# Altium project bailey.PrjPcb (part 4 of 11)
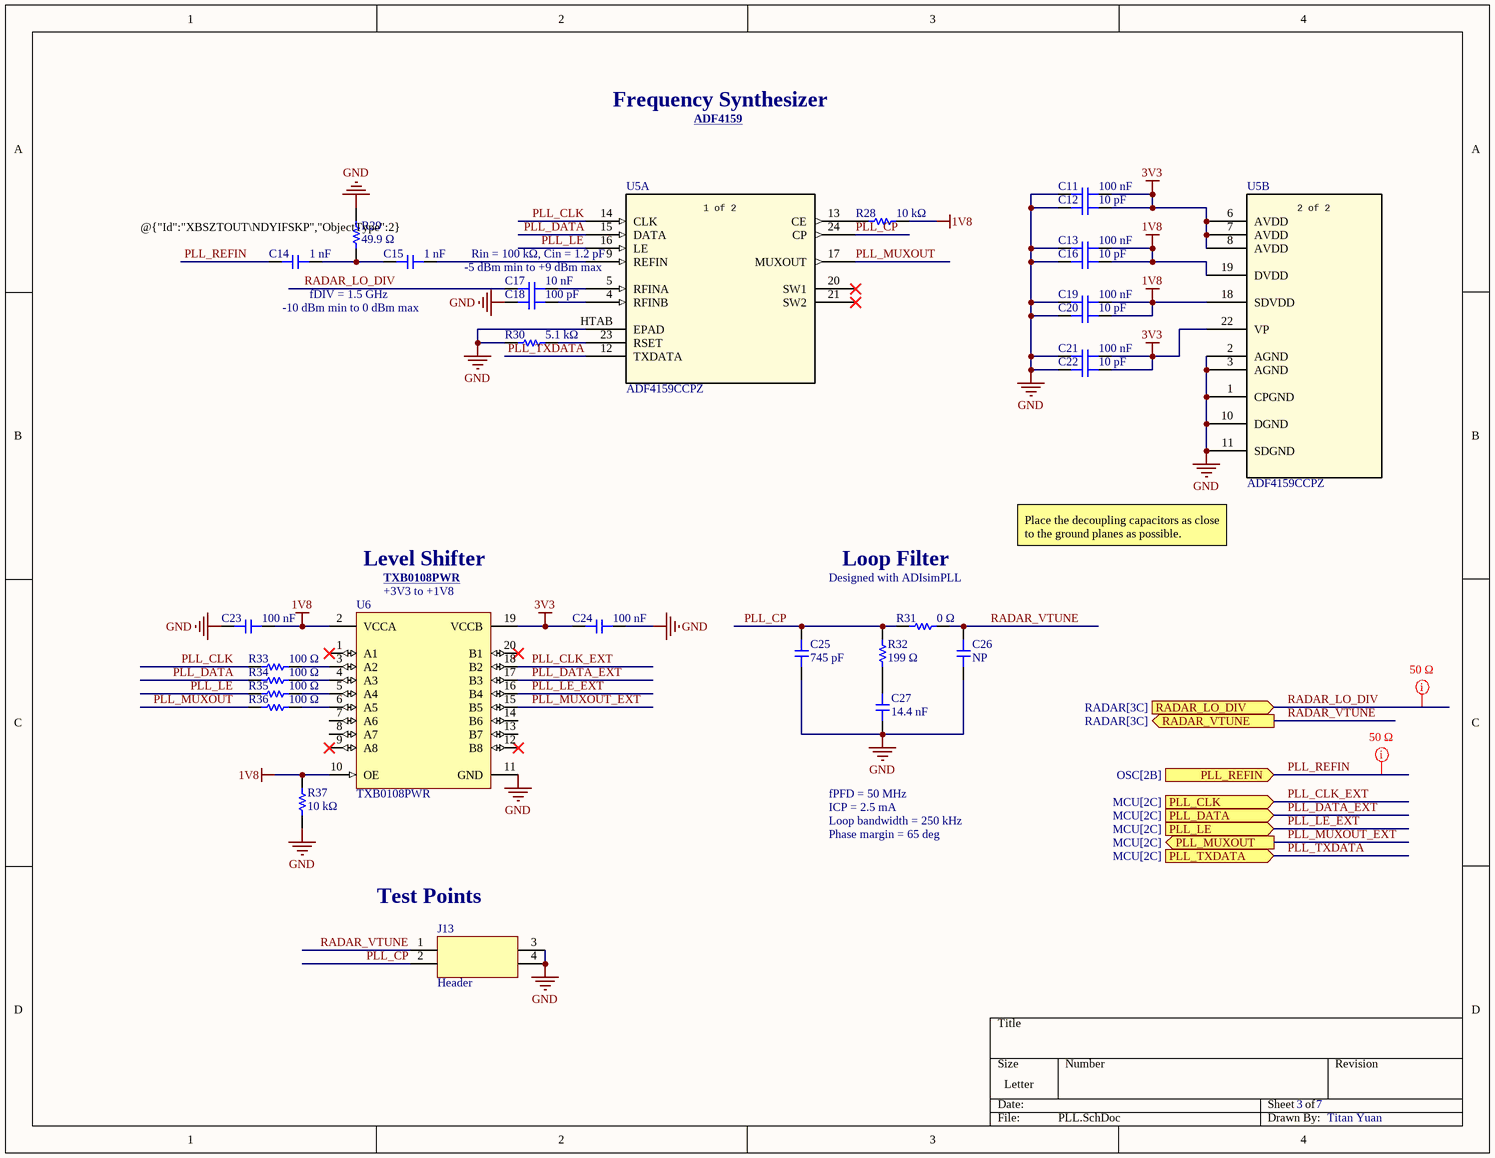
[diagram p9: PLL.SchDoc]

## Sheet PLL.SchDoc (continued)
### Library data of the parts
C11 C13 C19 C21 C23 C24 = CAP: 25V 100nF X7R ±10% 0402 Multilayer Ceramic Capacitors MLCC - SMD/SMT ROHS; Manufacturer: Samsung Electro-Mechanics; Manufacturer Part Number: CL05B104KA5NNNC; Tolerance: 10%; Voltage Rating: 25 V; Dielectric: Ceramic; Package Size: 0402; Supplier: DigiKey; Supplier Part Number: 1276-6720-1-ND; RoHS: Compliant; Category: Ceramic Capacitors; Stock: 5149468; Pricing: 1=0.08, 10=0.002 (USD); Value: 100nF; Case/Package: 0402; Case Code (Imperial): 0402; Case Code (Metric): 1005; China RoHS: Compliant; Country of Origin: Mainland China, Philippines, South Korea; Dielectric Material: Ceramic; Export Control Classification Number (ECCN) Code: EAR99; Height: 500µm; Harmonized Tariff Schedule (HTS) Code: 8532.24.00.20; Introduction Date: 2009-10-27; Length: 1mm; Lifecycle Status: Production; Material: Ceramic; Max Operating Temperature: 125°C; Min Operating Temperature: -55°C; Mounting Technology: Surface Mount; Number of Terminals: 2; REACH SVHC: Yes; Schedule B: 8532240020, 8532240020|8532240020|8532240020|8532240020|8532240020|8532240020|8532240020|8532240020|8532240020|8532240020|8532240020|8532240020|8532240020|8532240020|8532240020|8532240020|8532240020|8532240020|8532240020|8532240020|8532240020|8532240020|8532240020|85; Thickness: 558.8µm; Voltage Rating (DC): 25V; Width: 500µm; ComponentLink1URL: https://datasheet.octopart.com:443/CL05B104KA5NNNC-Samsung-Electro-Mechanics-datasheet-136876160.pdf?src-supplier=Samsung+SCT; ComponentLink1Description: https://datasheet.octopart.com:443/CL05B104KA5NNNC-Samsung-Electro-Mechanics-datasheet-136876160.pdf?src-supplier=Samsung+SCT; ComponentLink2URL: https://datasheet.octopart.com:443/CL05B104KA5NNNC-Samsung-Electro-Mechanics-datasheet-116890910.pdf?src-supplier=Future+Electronics; ComponentLink2Description: https://datasheet.octopart.com:443/CL05B104KA5NNNC-Samsung-Electro-Mechanics-datasheet-116890910.pdf?src-supplier=Future+Electronics; ComponentLink3URL: https://datasheet.octopart.com:443/CL05B104KA5NNNC-Samsung-Electro-Mechanics-datasheet-104201047.pdf?src-supplier=Future+Electronics; ComponentLink3Description: https://datasheet.octopart.com:443/CL05B104KA5NNNC-Samsung-Electro-Mechanics-datasheet-104201047.pdf?src-supplier=Future+Electronics; ComponentLink4URL: https://datasheet.octopart.com:443/CL05B104KA5NNNC-Samsung-Electro-Mechanics-datasheet-148801811.pdf?src-supplier=Future+Electronics; ComponentLink4Description: https://datasheet.octopart.com:443/CL05B104KA5NNNC-Samsung-Electro-Mechanics-datasheet-148801811.pdf?src-supplier=Future+Electronics; ComponentLink5URL: https://datasheet.octopart.com/CL05B104KA5NNNC-Samsung-Electro-Mechanics-datasheet-97040617.pdf; ComponentLink5Description: https://datasheet.octopart.com/CL05B104KA5NNNC-Samsung-Electro-Mechanics-datasheet-97040617.pdf; ComponentLink6URL: https://datasheet.octopart.com/CL05B104KA5NNNC-Samsung-Electro-Mechanics-datasheet-8324245.pdf; ComponentLink6Description: https://datasheet.octopart.com/CL05B104KA5NNNC-Samsung-Electro-Mechanics-datasheet-8324245.pdf; ComponentLink7URL: https://datasheet.octopart.com/General-Multilayer-Ceramic-Capacitors-Samsung-datasheet-family-111.pdf; ComponentLink7Description: https://datasheet.octopart.com/General-Multilayer-Ceramic-Capacitors-Samsung-datasheet-family-111.pdf; ComponentLink8URL: https://datasheet.octopart.com:443/CL05B104KA5NNNC-Samsung-datasheet-8326407.pdf?src-supplier=TME; ComponentLink8Description: https://datasheet.octopart.com:443/CL05B104KA5NNNC-Samsung-datasheet-8326407.pdf?src-supplier=TME; ComponentLink9URL: http://sigma.octopart.com:80/rohs_certificate/General-Multilayer-Ceramic-Capacitors-Samsung-family-110.pdf?src-supplier=Compliance+Statements; ComponentLink9Description: http://sigma.octopart.com:80/rohs_certificate/General-Multilayer-Ceramic-Capacitors-Samsung-family-110.pdf?src-supplier=Compliance+Statements; ComponentLink10URL: http://sigma.octopart.com:80/rohs_statement/General-Multilayer-Ceramic-Capacitors-Samsung-family-132.pdf?src-supplier=Compliance+Statements; ComponentLink10Description: http://sigma.octopart.com:80/rohs_statement/General-Multilayer-Ceramic-Capacitors-Samsung-family-132.pdf?src-supplier=Compliance+Statements; ComponentLink11URL: http://sigma.octopart.com:80/reach_statement/General-Multilayer-Ceramic-Capacitors-Samsung-family-133.pdf?src-supplier=Compliance+Statements; ComponentLink11Description: http://sigma.octopart.com:80/reach_statement/General-Multilayer-Ceramic-Capacitors-Samsung-family-133.pdf?src-supplier=Compliance+Statements
C12 C16 C20 C22 = CAP: 50V 10pF C0G ±5% 0402 Multilayer Ceramic Capacitors MLCC - SMD/SMT ROHS; Manufacturer: Murata Electronics; Manufacturer Part Number: GRM1555C1H100JA01D; Manufacturer Lifecycle Status: NRND; Temperature Coefficient: 30ppm/°C; Tolerance: 5%; Voltage Rating: 50 V; Dielectric: Ceramic; Package Size: 0402; Supplier: DigiKey; Supplier Part Number: 490-5921-1-ND; RoHS: Compliant; Category: Ceramic Capacitors; Stock: 712856; Pricing: 1=0.1, 10=0.022, 50=0.0144, 100=0.0122, 500=0.0085, 1000=0.00738, 2500=0.0062, 5000=0.0055, 10000=0.00503, 20000=0.00454, 30000=0.0043, 50000=0.00404, 70000=0.00388, 100000=0.00373, 120000=0.00366, 240000=0.00342, 250000=0.00341 (USD); Value: 10pF; Case/Package: 0402; Case Code (Imperial): 0402; Case Code (Metric): 1005; Country of Origin: Singapore; Depth: 500µm; Dielectric Material: Ceramic; Export Control Classification Number (ECCN) Code: EAR99; Height: 500µm; Harmonized Tariff Schedule (HTS) Code: 8532.24.00.20; Introduction Date: 2003-10-14; Lead Free: Lead Free; Length: 1mm; Lifecycle Status: NRND; Material: Ceramic; Max Operating Temperature: 125°C; Min Operating Temperature: -55°C; Mounting Technology: Surface Mount; Pins: 2; Number of Terminals: 2; Packaging: Cut Tape; Radiation Hardening: No; REACH SVHC: Yes; Schedule B: 8532240020, 8532240020|8532240020, 8532240020|8532240020|8532240020, 8532240020|8532240020|8532240020|8532240020; Termination: SMD/SMT; Thickness: 500µm; Voltage: 50V; Voltage Rating (DC): 50V; Width: 500µm; ComponentLink1URL: https://datasheet.octopart.com:443/GRM1555C1H100JA01D-Murata-datasheet-12559435.pdf?src-supplier=element14+APAC; ComponentLink1Description: https://datasheet.octopart.com:443/GRM1555C1H100JA01D-Murata-datasheet-12559435.pdf?src-supplier=element14+APAC; ComponentLink2URL: https://datasheet.octopart.com:443/GRM1555C1H100JA01D-Murata-datasheet-62317042.pdf?src-supplier=element14+APAC; ComponentLink2Description: https://datasheet.octopart.com:443/GRM1555C1H100JA01D-Murata-datasheet-62317042.pdf?src-supplier=element14+APAC; ComponentLink3URL: https://datasheet.octopart.com:443/GRM1555C1H100JA01D-Murata-datasheet-501912.pdf?src-supplier=element14+APAC; ComponentLink3Description: https://datasheet.octopart.com:443/GRM1555C1H100JA01D-Murata-datasheet-501912.pdf?src-supplier=element14+APAC; ComponentLink4URL: https://datasheet.octopart.com:443/GRM1555C1H100JA01D-Murata-datasheet-11857477.pdf?src-supplier=_legacy+Avnet; ComponentLink4Description: https://datasheet.octopart.com:443/GRM1555C1H100JA01D-Murata-datasheet-11857477.pdf?src-supplier=_legacy+Avnet; ComponentLink5URL: https://datasheet.octopart.com:443/GRM1555C1H100JA01D-Murata-datasheet-14396362.pdf?src-supplier=Future+Electronics; ComponentLink5Description: https://datasheet.octopart.com:443/GRM1555C1H100JA01D-Murata-datasheet-14396362.pdf?src-supplier=Future+Electronics; ComponentLink6URL: https://datasheet.octopart.com:443/GRM1555C1H100JA01D-Murata-datasheet-22122223.pdf?src-supplier=Future+Electronics; ComponentLink6Description: https://datasheet.octopart.com:443/GRM1555C1H100JA01D-Murata-datasheet-22122223.pdf?src-supplier=Future+Electronics; ComponentLink7URL: https://datasheet.octopart.com:443/GRM1555C1H100JA01D-Murata-datasheet-44105796.pdf?src-supplier=Future+Electronics; ComponentLink7Description: https://datasheet.octopart.com:443/GRM1555C1H100JA01D-Murata-datasheet-44105796.pdf?src-supplier=Future+Electronics; ComponentLink8URL: https://datasheet.octopart.com:443/GRM1555C1H100JA01D-Murata-datasheet-165579666.pdf?src-supplier=TME; ComponentLink8Description: https://datasheet.octopart.com:443/GRM1555C1H100JA01D-Murata-datasheet-165579666.pdf?src-supplier=TME; ComponentLink9URL: https://datasheet.octopart.com:443/GRM1555C1H100JA01D-Murata-datasheet-59876780.pdf?src-supplier=TME; ComponentLink9Description: https://datasheet.octopart.com:443/GRM1555C1H100JA01D-Murata-datasheet-59876780.pdf?src-supplier=TME; ComponentLink10URL: https://datasheet.octopart.com:443/GRM1555C1H100JA01D-Murata-datasheet-141266224.pdf?src-supplier=Ciiva; ComponentLink10Description: https://datasheet.octopart.com:443/GRM1555C1H100JA01D-Murata-datasheet-141266224.pdf?src-supplier=Ciiva; ComponentLink11URL: https://datasheet.octopart.com:443/GRM1555C1H100JA01D-Murata-datasheet-140680755.pdf?src-supplier=Ciiva; ComponentLink11Description: https://datasheet.octopart.com:443/GRM1555C1H100JA01D-Murata-datasheet-140680755.pdf?src-supplier=Ciiva; ComponentLink12URL: https://datasheet.octopart.com:443/GRM1555C1H100JA01D-Murata-datasheet-138739439.pdf?src-supplier=Ciiva; ComponentLink12Description: https://datasheet.octopart.com:443/GRM1555C1H100JA01D-Murata-datasheet-138739439.pdf?src-supplier=Ciiva; ComponentLink13URL: https://datasheet.octopart.com/GRM1555C1H100JA01D-Murata-datasheet-12515295.pdf; ComponentLink13Description: https://datasheet.octopart.com/GRM1555C1H100JA01D-Murata-datasheet-12515295.pdf; ComponentLink14URL: https://datasheet.octopart.com/GRM1555C1H100JA01D-Murata-datasheet-12510076.pdf; ComponentLink14Description: https://datasheet.octopart.com/GRM1555C1H100JA01D-Murata-datasheet-12510076.pdf; ComponentLink15URL: https://datasheet.octopart.com/GRM1555C1H100JA01D-Murata-datasheet-11978611.pdf; ComponentLink15Description: https://datasheet.octopart.com/GRM1555C1H100JA01D-Murata-datasheet-11978611.pdf; ComponentLink16URL: https://datasheet.octopart.com/GRM1555C1H100JA01D-Murata-datasheet-10025737.pdf; ComponentLink16Description: https://datasheet.octopart.com/GRM1555C1H100JA01D-Murata-datasheet-10025737.pdf; ComponentLink17URL: https://datasheet.octopart.com/GRM1555C1H100JA01D-Murata-datasheet-8819587.pdf; ComponentLink17Description: https://datasheet.octopart.com/GRM1555C1H100JA01D-Murata-datasheet-8819587.pdf; ComponentLink18URL: http://sigma.octopart.com:80/reach_statement/Murata-company-16.pdf?src-supplier=Compliance+Statements; ComponentLink18Description: http://sigma.octopart.com:80/reach_statement/Murata-company-16.pdf?src-supplier=Compliance+Statements
C14 C15 = CAP: 50V 1nF X7R ±10% 0402 Multilayer Ceramic Capacitors MLCC - SMD/SMT ROHS; Manufacturer: Yageo; Manufacturer Part Number: CC0402KRX7R9BB102; Insulation Resistance: 100GΩ; Temperature Coefficient: 30ppm/°C; Tolerance: 10%; Voltage Rating: 50 V; Dielectric: Ceramic; Package Size: 0402; Supplier: DigiKey; Supplier Part Number: 311-1036-1-ND; RoHS: Compliant; Category: Ceramic Capacitors; Stock: 1584347; Pricing: 1=0.08, 10=0.003, 10000=0.0024 (USD); Value: 1nF; Case/Package: 0402; Case Code (Imperial): 0402; Case Code (Metric): 1005; China RoHS: Compliant; Composition: Ceramic; Country of Origin: Mainland China, Taiwan; Depth: 500µm; Dielectric Material: Ceramic; Export Control Classification Number (ECCN) Code: EAR99; Halogen Free: Halogen Free; Height: 500µm; Harmonized Tariff Schedule (HTS) Code: 8532.24.00.20; Introduction Date: 2003-01-27; Lead Free: Lead Free; Length: 1mm; Lifecycle Status: Production; Material: Ceramic; Max Operating Temperature: 125°C; Min Operating Temperature: -55°C; Mounting Technology: Surface Mount; Pins: 2; Number of Terminals: 2; Radiation Hardening: No; REACH SVHC: Yes; Schedule B: 8532240020, 8532240020|8532240020|8532240020|8532240020|8532240020|8532240020|8532240020|8532240020|8532240020|8532240020|8532240020|8532240020|8532240020|8532240020|8532240020|8532240020|8532240020|8532240020|8532240020|8532240020|8532240020|8532240020|8532240020|85; Termination: SMD/SMT; Thickness: 558.8µm; Voltage: 50V; Voltage Rating (AC): 50V; Voltage Rating (DC): 50V; Width: 500µm; ComponentLink1URL: https://datasheet.octopart.com:443/CC0402KRX7R9BB102-Yageo-datasheet-177165144.pdf?src-supplier=IHS; ComponentLink1Description: https://datasheet.octopart.com:443/CC0402KRX7R9BB102-Yageo-datasheet-177165144.pdf?src-supplier=IHS; ComponentLink2URL: https://datasheet.octopart.com:443/CC0402KRX7R9BB102-Yageo-datasheet-82288757.pdf?src-supplier=Upverter; ComponentLink2Description: https://datasheet.octopart.com:443/CC0402KRX7R9BB102-Yageo-datasheet-82288757.pdf?src-supplier=Upverter; ComponentLink3URL: https://datasheet.octopart.com:443/CC0402KRX7R9BB102-Yageo-datasheet-78855684.pdf?src-supplier=Upverter; ComponentLink3Description: https://datasheet.octopart.com:443/CC0402KRX7R9BB102-Yageo-datasheet-78855684.pdf?src-supplier=Upverter; ComponentLink4URL: https://datasheet.octopart.com/CC0402KRX7R9BB102-Yageo-datasheet-10883670.pdf; ComponentLink4Description: https://datasheet.octopart.com/CC0402KRX7R9BB102-Yageo-datasheet-10883670.pdf; ComponentLink5URL: https://datasheet.octopart.com/CC0402KRX7R9BB102-Yageo-datasheet-12526321.pdf; ComponentLink5Description: https://datasheet.octopart.com/CC0402KRX7R9BB102-Yageo-datasheet-12526321.pdf; ComponentLink6URL: https://datasheet.octopart.com:443/CC0402KRX7R9BB102-Yageo-datasheet-147453679.pdf?src-supplier=Farnell; ComponentLink6Description: https://datasheet.octopart.com:443/CC0402KRX7R9BB102-Yageo-datasheet-147453679.pdf?src-supplier=Farnell; ComponentLink7URL: https://datasheet.octopart.com:443/CC0402KRX7R9BB102-Yageo-datasheet-151948686.pdf?src-supplier=Farnell; ComponentLink7Description: https://datasheet.octopart.com:443/CC0402KRX7R9BB102-Yageo-datasheet-151948686.pdf?src-supplier=Farnell; ComponentLink8URL: https://datasheet.octopart.com:443/CC0402KRX7R9BB102-Phycomp-datasheet-500777.pdf?src-supplier=Farnell; ComponentLink8Description: https://datasheet.octopart.com:443/CC0402KRX7R9BB102-Phycomp-datasheet-500777.pdf?src-supplier=Farnell; ComponentLink9URL: https://datasheet.octopart.com:443/CC0402KRX7R9BB102-Yageo-datasheet-5301394.pdf?src-supplier=Newark; ComponentLink9Description: https://datasheet.octopart.com:443/CC0402KRX7R9BB102-Yageo-datasheet-5301394.pdf?src-supplier=Newark; ComponentLink10URL: https://datasheet.octopart.com:443/CC0402KRX7R9BB102-Yageo-datasheet-62336348.pdf?src-supplier=Newark; ComponentLink10Description: https://datasheet.octopart.com:443/CC0402KRX7R9BB102-Yageo-datasheet-62336348.pdf?src-supplier=Newark; ComponentLink11URL: https://datasheet.octopart.com:443/CC0402KRX7R9BB102-Yageo-datasheet-182878162.pdf?src-supplier=Newark; ComponentLink11Description: https://datasheet.octopart.com:443/CC0402KRX7R9BB102-Yageo-datasheet-182878162.pdf?src-supplier=Newark; ComponentLink12URL: https://datasheet.octopart.com:443/CC0402KRX7R9BB102-Phycomp-datasheet-499490.pdf?src-supplier=element14; ComponentLink12Description: https://datasheet.octopart.com:443/CC0402KRX7R9BB102-Phycomp-datasheet-499490.pdf?src-supplier=element14; ComponentLink13URL: https://datasheet.octopart.com:443/CC0402KRX7R9BB102-Yageo-datasheet-8701427.pdf?src-supplier=element14; ComponentLink13Description: https://datasheet.octopart.com:443/CC0402KRX7R9BB102-Yageo-datasheet-8701427.pdf?src-supplier=element14; ComponentLink14URL: https://datasheet.octopart.com:443/CC0402KRX7R9BB102-Yageo-datasheet-166511530.pdf?src-supplier=Future+Electronics; ComponentLink14Description: https://datasheet.octopart.com:443/CC0402KRX7R9BB102-Yageo-datasheet-166511530.pdf?src-supplier=Future+Electronics; ComponentLink15URL: https://datasheet.octopart.com:443/CC0402KRX7R9BB102-Yageo-datasheet-137700082.pdf?src-supplier=Future+Electronics; ComponentLink15Description: https://datasheet.octopart.com:443/CC0402KRX7R9BB102-Yageo-datasheet-137700082.pdf?src-supplier=Future+Electronics; ComponentLink16URL: https://datasheet.octopart.com:443/CC0402KRX7R9BB102-Yageo-datasheet-137700084.pdf?src-supplier=Future+Electronics; ComponentLink16Description: https://datasheet.octopart.com:443/CC0402KRX7R9BB102-Yageo-datasheet-137700084.pdf?src-supplier=Future+Electronics; ComponentLink17URL: https://datasheet.octopart.com:443/CC0402KRX7R9BB102-Yageo-datasheet-78855685.pdf?src-supplier=Future+Electronics; ComponentLink17Description: https://datasheet.octopart.com:443/CC0402KRX7R9BB102-Yageo-datasheet-78855685.pdf?src-supplier=Future+Electronics; ComponentLink18URL: https://datasheet.octopart.com:443/CC0402KRX7R9BB102-Yageo-datasheet-27626582.pdf?src-supplier=Future+Electronics; ComponentLink18Description: https://datasheet.octopart.com:443/CC0402KRX7R9BB102-Yageo-datasheet-27626582.pdf?src-supplier=Future+Electronics; ComponentLink19URL: https://datasheet.octopart.com:443/CC0402KRX7R9BB102-Yageo-datasheet-24578986.pdf?src-supplier=Future+Electronics; ComponentLink19Description: https://datasheet.octopart.com:443/CC0402KRX7R9BB102-Yageo-datasheet-24578986.pdf?src-supplier=Future+Electronics; ComponentLink20URL: https://datasheet.octopart.com:443/CC0402KRX7R9BB102-Yageo-datasheet-15895757.pdf?src-supplier=Future+Electronics; ComponentLink20Description: https://datasheet.octopart.com:443/CC0402KRX7R9BB102-Yageo-datasheet-15895757.pdf?src-supplier=Future+Electronics; ComponentLink21URL: https://datasheet.octopart.com:443/CC0402KRX7R9BB102-Yageo-datasheet-8324192.pdf?src-supplier=Future+Electronics; ComponentLink21Description: https://datasheet.octopart.com:443/CC0402KRX7R9BB102-Yageo-datasheet-8324192.pdf?src-supplier=Future+Electronics; ComponentLink22URL: https://datasheet.octopart.com:443/CC0402KRX7R9BB102-Yageo-datasheet-68298032.pdf?src-supplier=Future+Electronics; ComponentLink22Description: https://datasheet.octopart.com:443/CC0402KRX7R9BB102-Yageo-datasheet-68298032.pdf?src-supplier=Future+Electronics; ComponentLink23URL: https://datasheet.octopart.com:443/CC0402KRX7R9BB102-Yageo-datasheet-178018854.pdf?src-supplier=Burklin+Elektronik; ComponentLink23Description: https://datasheet.octopart.com:443/CC0402KRX7R9BB102-Yageo-datasheet-178018854.pdf?src-supplier=Burklin+Elektronik; ComponentLink24URL: https://datasheet.octopart.com:443/CC0402KRX7R9BB102-Yageo-Group-datasheet-165992755.pdf?src-supplier=ODG+(Origin+Data+Global); ComponentLink24Description: https://datasheet.octopart.com:443/CC0402KRX7R9BB102-Yageo-Group-datasheet-165992755.pdf?src-supplier=ODG+(Origin+Data+Global); ComponentLink25URL: https://datasheet.octopart.com:443/CC0402KRX7R9BB102-Yageo-datasheet-120101875.pdf?src-supplier=Megastar; ComponentLink25Description: https://datasheet.octopart.com:443/CC0402KRX7R9BB102-Yageo-datasheet-120101875.pdf?src-supplier=Megastar; ComponentLink26URL: https://datasheet.octopart.com:443/CC0402KRX7R9BB102-Yageo-datasheet-118396.pdf?src-supplier=DigiKey; ComponentLink26Description: https://datasheet.octopart.com:443/CC0402KRX7R9BB102-Yageo-datasheet-118396.pdf?src-supplier=DigiKey; ComponentLink27URL: http://sigma.octopart.com:80/rohs_statement/Surface-Mount-Ceramic-Multilayer-Capacitors%3B-General-Purpose-%26-High-Capacitance-Class-2%2C-X7R-Yageo-family-124.pdf?src-supplier=Compliance+Statements; ComponentLink27Description: http://sigma.octopart.com:80/rohs_statement/Surface-Mount-Ceramic-Multilayer-Capacitors%3B-General-Purpose-%26-High-Capacitance-Class-2%2C-X7R-Yageo-family-124.pdf?src-supplier=Compliance+Statements; ComponentLink28URL: http://sigma.octopart.com:80/reach_statement/Surface-Mount-Ceramic-Multilayer-Capacitors%3B-General-Purpose-%26-High-Capacitance-Class-2%2C-X7R-Yageo-family-125.pdf?src-supplier=Compliance+Statements; ComponentLink28Description: http://sigma.octopart.com:80/reach_statement/Surface-Mount-Ceramic-Multilayer-Capacitors%3B-General-Purpose-%26-High-Capacitance-Class-2%2C-X7R-Yageo-family-125.pdf?src-supplier=Compliance+Statements; ComponentLink29URL: http://sigma.octopart.com:80/conflict_mineral_statement/Yageo-company-3.pdf?src-supplier=Compliance+Statements; ComponentLink29Description: http://sigma.octopart.com:80/conflict_mineral_statement/Yageo-company-3.pdf?src-supplier=Compliance+Statements; ComponentLink30URL: http://sigma.octopart.com:80/rohs_statement/Yageo-company-2.pdf?src-supplier=Compliance+Statements; ComponentLink30Description: http://sigma.octopart.com:80/rohs_statement/Yageo-company-2.pdf?src-supplier=Compliance+Statements
C17 = CAP: Ceramic Capacitor, Ceramic, 50V, 10% +Tol, 10% -Tol, X7R, 15% TC, 0.01uF, Surface Mount, 0402; Manufacturer: Yageo; Manufacturer Part Number: CC0402KPX7R9BB103; Value: 10nF; Temperature Coefficient: 30ppm/°C; Tolerance: 10%; Voltage Rating: 50 V; Dielectric: Ceramic; Package Size: 0402; Supplier: DigiKey; Supplier Part Number: 13-CC0402KPX7R9BB103CT-ND; RoHS: Compliant; Category: Ceramic Capacitors; Stock: 222524; Pricing: 1=0.1, 10=0.018, 50=0.012, 100=0.0101, 500=0.007, 1000=0.00606, 2500=0.00507, 5000=0.00448 (USD); Case/Package: 0402; Case Code (Imperial): 0402; Case Code (Metric): 1005; China RoHS: Compliant; Composition: Ceramic; Country of Origin: Mainland China, Taiwan; Depth: 500µm; Dielectric Material: Ceramic; Export Control Classification Number (ECCN) Code: EAR99; Halogen Free: Halogen Free; Height: 500µm; Harmonized Tariff Schedule (HTS) Code: 8532.24.00.20; Introduction Date: 2004-02-24; Lead Free: Lead Free; Length: 1mm; Lifecycle Status: Production; Material: Ceramic; Max Operating Temperature: 125°C; Min Operating Temperature: -55°C; Mounting Technology: Surface Mount; Number of Terminals: 2; Packaging: Tape and Reel; REACH SVHC: Yes; Termination: SMD/SMT; Voltage Rating (DC): 50V; Weight: 652.039032µg; Width: 500µm; ComponentLink1URL: https://datasheet.octopart.com:443/CC0402KPX7R9BB103-Yageo-datasheet-177165144.pdf?src-supplier=IHS; ComponentLink1Description: https://datasheet.octopart.com:443/CC0402KPX7R9BB103-Yageo-datasheet-177165144.pdf?src-supplier=IHS; ComponentLink2URL: https://datasheet.octopart.com:443/CC0402KPX7R9BB103-Yageo-datasheet-78855684.pdf?src-supplier=Upverter; ComponentLink2Description: https://datasheet.octopart.com:443/CC0402KPX7R9BB103-Yageo-datasheet-78855684.pdf?src-supplier=Upverter; ComponentLink3URL: https://datasheet.octopart.com/CC0402KPX7R9BB103-Yageo-datasheet-12526321.pdf; ComponentLink3Description: https://datasheet.octopart.com/CC0402KPX7R9BB103-Yageo-datasheet-12526321.pdf; ComponentLink4URL: https://datasheet.octopart.com/CC0402KPX7R9BB103-Yageo-datasheet-10883670.pdf; ComponentLink4Description: https://datasheet.octopart.com/CC0402KPX7R9BB103-Yageo-datasheet-10883670.pdf; ComponentLink5URL: https://datasheet.octopart.com:443/CC0402KPX7R9BB103-Yageo-datasheet-182965545.pdf?src-supplier=Farnell; ComponentLink5Description: https://datasheet.octopart.com:443/CC0402KPX7R9BB103-Yageo-datasheet-182965545.pdf?src-supplier=Farnell; ComponentLink6URL: https://datasheet.octopart.com:443/CC0402KPX7R9BB103-Yageo-datasheet-151948686.pdf?src-supplier=Farnell; ComponentLink6Description: https://datasheet.octopart.com:443/CC0402KPX7R9BB103-Yageo-datasheet-151948686.pdf?src-supplier=Farnell; ComponentLink7URL: https://datasheet.octopart.com:443/CC0402KPX7R9BB103-Yageo-datasheet-166511530.pdf?src-supplier=Future+Electronics; ComponentLink7Description: https://datasheet.octopart.com:443/CC0402KPX7R9BB103-Yageo-datasheet-166511530.pdf?src-supplier=Future+Electronics; ComponentLink8URL: https://datasheet.octopart.com:443/CC0402KPX7R9BB103-Yageo-datasheet-137700085.pdf?src-supplier=Future+Electronics; ComponentLink8Description: https://datasheet.octopart.com:443/CC0402KPX7R9BB103-Yageo-datasheet-137700085.pdf?src-supplier=Future+Electronics; ComponentLink9URL: https://datasheet.octopart.com:443/CC0402KPX7R9BB103-Yageo-datasheet-27626582.pdf?src-supplier=Future+Electronics; ComponentLink9Description: https://datasheet.octopart.com:443/CC0402KPX7R9BB103-Yageo-datasheet-27626582.pdf?src-supplier=Future+Electronics; ComponentLink10URL: https://datasheet.octopart.com:443/CC0402KPX7R9BB103-Yageo-datasheet-24578986.pdf?src-supplier=Future+Electronics; ComponentLink10Description: https://datasheet.octopart.com:443/CC0402KPX7R9BB103-Yageo-datasheet-24578986.pdf?src-supplier=Future+Electronics; ComponentLink11URL: https://datasheet.octopart.com:443/CC0402KPX7R9BB103-Yageo-datasheet-15895757.pdf?src-supplier=Future+Electronics; ComponentLink11Description: https://datasheet.octopart.com:443/CC0402KPX7R9BB103-Yageo-datasheet-15895757.pdf?src-supplier=Future+Electronics; ComponentLink12URL: http://sigma.octopart.com:80/rohs_statement/Surface-Mount-Ceramic-Multilayer-Capacitors%3B-General-Purpose-%26-High-Capacitance-Class-2%2C-X7R-Yageo-family-124.pdf?src-supplier=Compliance+Statements; ComponentLink12Description: http://sigma.octopart.com:80/rohs_statement/Surface-Mount-Ceramic-Multilayer-Capacitors%3B-General-Purpose-%26-High-Capacitance-Class-2%2C-X7R-Yageo-family-124.pdf?src-supplier=Compliance+Statements; ComponentLink13URL: http://sigma.octopart.com:80/reach_statement/Surface-Mount-Ceramic-Multilayer-Capacitors%3B-General-Purpose-%26-High-Capacitance-Class-2%2C-X7R-Yageo-family-125.pdf?src-supplier=Compliance+Statements; ComponentLink13Description: http://sigma.octopart.com:80/reach_statement/Surface-Mount-Ceramic-Multilayer-Capacitors%3B-General-Purpose-%26-High-Capacitance-Class-2%2C-X7R-Yageo-family-125.pdf?src-supplier=Compliance+Statements; ComponentLink14URL: http://sigma.octopart.com:80/conflict_mineral_statement/Yageo-company-3.pdf?src-supplier=Compliance+Statements; ComponentLink14Description: http://sigma.octopart.com:80/conflict_mineral_statement/Yageo-company-3.pdf?src-supplier=Compliance+Statements; ComponentLink15URL: http://sigma.octopart.com:80/rohs_statement/Yageo-company-2.pdf?src-supplier=Compliance+Statements; ComponentLink15Description: http://sigma.octopart.com:80/rohs_statement/Yageo-company-2.pdf?src-supplier=Compliance+Statements
C18 = CAP: 50V 100pF C0G ±5% 0402 Multilayer Ceramic Capacitors MLCC - SMD/SMT ROHS; Manufacturer: Samsung Electro-Mechanics; Manufacturer Part Number: CL05C101JB5NNNC; Temperature Coefficient: 30ppm/°C; Tolerance: 5%; Voltage Rating: 50 V; Dielectric: Ceramic; Package Size: 0402; Supplier: DigiKey; Supplier Part Number: 1276-1025-1-ND; RoHS: Compliant; Category: Ceramic Capacitors; Stock: 2037674; Pricing: 1=0.08, 10=0.003 (USD); Value: 100pF; Case/Package: 0402; Case Code (Imperial): 0402; Case Code (Metric): 1005; China RoHS: Compliant; Contact Plating: Tin; Country of Origin: Mainland China, Philippines, South Korea; Depth: 500µm; Dielectric Material: Ceramic; Export Control Classification Number (ECCN) Code: EAR99; Height: 550µm; Harmonized Tariff Schedule (HTS) Code: 8532.24.00.20; Introduction Date: 2007-11-14; Length: 1mm; Lifecycle Status: Production; Material: Ceramic; Max Operating Temperature: 125°C; Min Operating Temperature: -55°C; Mounting Technology: Surface Mount; Number of Terminals: 2; Radiation Hardening: No; REACH SVHC: Yes; Schedule B: 8532240020, 8532240020|8532240020, 8532240020|8532240020|8532240020, 8532240020|8532240020|8532240020|8532240020; Thickness: 558.8µm; Voltage: 50V; Voltage Rating (DC): 50V; Width: 500µm; ComponentLink1URL: https://datasheet.octopart.com:443/CL05C101JB5NNNC-Samsung-Electro-Mechanics-datasheet-136482243.pdf?src-supplier=Upverter; ComponentLink1Description: https://datasheet.octopart.com:443/CL05C101JB5NNNC-Samsung-Electro-Mechanics-datasheet-136482243.pdf?src-supplier=Upverter; ComponentLink2URL: https://datasheet.octopart.com/CL05C101JB5NNNC-Samsung-Electro-Mechanics-datasheet-8324245.pdf; ComponentLink2Description: https://datasheet.octopart.com/CL05C101JB5NNNC-Samsung-Electro-Mechanics-datasheet-8324245.pdf; ComponentLink3URL: https://datasheet.octopart.com/CL05C101JB5NNNC-Samsung-Electro-Mechanics-datasheet-97040617.pdf; ComponentLink3Description: https://datasheet.octopart.com/CL05C101JB5NNNC-Samsung-Electro-Mechanics-datasheet-97040617.pdf; ComponentLink4URL: https://datasheet.octopart.com/General-Multilayer-Ceramic-Capacitors-Samsung-datasheet-family-111.pdf; ComponentLink4Description: https://datasheet.octopart.com/General-Multilayer-Ceramic-Capacitors-Samsung-datasheet-family-111.pdf; ComponentLink5URL: https://datasheet.octopart.com:443/CL05C101JB5NNNC-Samsung-Electro-Mechanics-datasheet-141346959.pdf?src-supplier=Samsung+SCT; ComponentLink5Description: https://datasheet.octopart.com:443/CL05C101JB5NNNC-Samsung-Electro-Mechanics-datasheet-141346959.pdf?src-supplier=Samsung+SCT; ComponentLink6URL: https://datasheet.octopart.com:443/CL05C101JB5NNNC-Samsung-Electro-Mechanics-datasheet-110326792.pdf?src-supplier=Future+Electronics; ComponentLink6Description: https://datasheet.octopart.com:443/CL05C101JB5NNNC-Samsung-Electro-Mechanics-datasheet-110326792.pdf?src-supplier=Future+Electronics; ComponentLink7URL: https://datasheet.octopart.com:443/CL05C101JB5NNNC-Samsung-Electro-Mechanics-datasheet-81461704.pdf?src-supplier=Future+Electronics; ComponentLink7Description: https://datasheet.octopart.com:443/CL05C101JB5NNNC-Samsung-Electro-Mechanics-datasheet-81461704.pdf?src-supplier=Future+Electronics; ComponentLink8URL: https://datasheet.octopart.com:443/CL05C101JB5NNNC-Samsung-datasheet-26589069.pdf?src-supplier=Future+Electronics; ComponentLink8Description: https://datasheet.octopart.com:443/CL05C101JB5NNNC-Samsung-datasheet-26589069.pdf?src-supplier=Future+Electronics; ComponentLink9URL: https://datasheet.octopart.com:443/CL05C101JB5NNNC-Samsung-Electro-Mechanics-datasheet-149136758.pdf?src-supplier=Future+Electronics; ComponentLink9Description: https://datasheet.octopart.com:443/CL05C101JB5NNNC-Samsung-Electro-Mechanics-datasheet-149136758.pdf?src-supplier=Future+Electronics; ComponentLink10URL: https://datasheet.octopart.com:443/CL05C101JB5NNNC-Samsung-datasheet-37081328.pdf?src-supplier=Future+Electronics; ComponentLink10Description: https://datasheet.octopart.com:443/CL05C101JB5NNNC-Samsung-datasheet-37081328.pdf?src-supplier=Future+Electronics; ComponentLink11URL: https://datasheet.octopart.com:443/CL05C101JB5NNNC-Samsung-datasheet-8326407.pdf?src-supplier=TME; ComponentLink11Description: https://datasheet.octopart.com:443/CL05C101JB5NNNC-Samsung-datasheet-8326407.pdf?src-supplier=TME; ComponentLink12URL: http://sigma.octopart.com:80/rohs_certificate/General-Multilayer-Ceramic-Capacitors-Samsung-family-110.pdf?src-supplier=Compliance+Statements; ComponentLink12Description: http://sigma.octopart.com:80/rohs_certificate/General-Multilayer-Ceramic-Capacitors-Samsung-family-110.pdf?src-supplier=Compliance+Statements; ComponentLink13URL: http://sigma.octopart.com:80/rohs_statement/General-Multilayer-Ceramic-Capacitors-Samsung-family-132.pdf?src-supplier=Compliance+Statements; ComponentLink13Description: http://sigma.octopart.com:80/rohs_statement/General-Multilayer-Ceramic-Capacitors-Samsung-family-132.pdf?src-supplier=Compliance+Statements; ComponentLink14URL: http://sigma.octopart.com:80/reach_statement/General-Multilayer-Ceramic-Capacitors-Samsung-family-133.pdf?src-supplier=Compliance+Statements; ComponentLink14Description: http://sigma.octopart.com:80/reach_statement/General-Multilayer-Ceramic-Capacitors-Samsung-family-133.pdf?src-supplier=Compliance+Statements
C25 = CAP: 0805 750 pF 50 V ±5% Tolerance C0G SMT Multilayer Ceramic Capacitor; Manufacturer: Murata Electronics; Manufacturer Part Number: GRM2165C1H751JA01D; Manufacturer Lifecycle Status: NRND; Voltage Rating: 50 V; Value: 750pF; Voltage Rating (DC): 50V; Tolerance: 5%; Dielectric: Ceramic; Package Size: 0805; Supplier: DigiKey; Supplier Part Number: 490-1620-1-ND; RoHS: Compliant; Category: Ceramic Capacitors; Stock: 12864; Pricing: 1=0.19, 10=0.107, 50=0.0762, 100=0.0667, 500=0.05076, 1000=0.04585 (USD); Case/Package: 0805; Case Code (Imperial): 0805; Case Code (Metric): 2012; Depth: 1.25mm; Dielectric Material: Ceramic; Export Control Classification Number (ECCN) Code: EAR99; Height: 600µm; Harmonized Tariff Schedule (HTS) Code: 8532.24.00.20; Introduction Date: 2013-11-20; Lead Free: Lead Free; Length: 2mm; Lifecycle Status: NRND; Material: Ceramic; Max Operating Temperature: 125°C; Min Operating Temperature: -55°C; Mounting Technology: Surface Mount; Number of Terminals: 2; REACH SVHC: Yes; Schedule B: 8532240020, 8532240020|8532240020|8532240020|8532240020|8532240020; Termination: SMD/SMT; Thickness: 600µm; Width: 1.25mm; ComponentLink1URL: https://datasheet.octopart.com:443/GRM2165C1H751JA01D-Murata-datasheet-141276297.pdf?src-supplier=Future+Electronics; ComponentLink1Description: https://datasheet.octopart.com:443/GRM2165C1H751JA01D-Murata-datasheet-141276297.pdf?src-supplier=Future+Electronics; ComponentLink2URL: https://datasheet.octopart.com:443/GRM2165C1H751JA01D-Murata-datasheet-22122223.pdf?src-supplier=Future+Electronics; ComponentLink2Description: https://datasheet.octopart.com:443/GRM2165C1H751JA01D-Murata-datasheet-22122223.pdf?src-supplier=Future+Electronics; ComponentLink3URL: https://datasheet.octopart.com/GRM2165C1H751JA01D-Murata-datasheet-8819587.pdf; ComponentLink3Description: https://datasheet.octopart.com/GRM2165C1H751JA01D-Murata-datasheet-8819587.pdf; ComponentLink4URL: https://datasheet.octopart.com/GRM2165C1H751JA01D-Murata-datasheet-12515295.pdf; ComponentLink4Description: https://datasheet.octopart.com/GRM2165C1H751JA01D-Murata-datasheet-12515295.pdf; ComponentLink5URL: https://datasheet.octopart.com/GRM2165C1H751JA01D-Murata-datasheet-12510076.pdf; ComponentLink5Description: https://datasheet.octopart.com/GRM2165C1H751JA01D-Murata-datasheet-12510076.pdf; ComponentLink6URL: https://datasheet.octopart.com/GRM2165C1H751JA01D-Murata-datasheet-11978611.pdf; ComponentLink6Description: https://datasheet.octopart.com/GRM2165C1H751JA01D-Murata-datasheet-11978611.pdf; ComponentLink7URL: https://datasheet.octopart.com/GRM2165C1H751JA01D-Murata-datasheet-10025737.pdf; ComponentLink7Description: https://datasheet.octopart.com/GRM2165C1H751JA01D-Murata-datasheet-10025737.pdf; ComponentLink8URL: https://datasheet.octopart.com/GRM2165C1H751JA01D-Murata-datasheet-14401321.pdf; ComponentLink8Description: https://datasheet.octopart.com/GRM2165C1H751JA01D-Murata-datasheet-14401321.pdf; ComponentLink9URL: https://datasheet.octopart.com:443/GRM2165C1H751JA01D-Murata-datasheet-140706047.pdf?src-supplier=Ciiva; ComponentLink9Description: https://datasheet.octopart.com:443/GRM2165C1H751JA01D-Murata-datasheet-140706047.pdf?src-supplier=Ciiva; ComponentLink10URL: https://datasheet.octopart.com:443/GRM2165C1H751JA01D-Murata-datasheet-138743557.pdf?src-supplier=Ciiva; ComponentLink10Description: https://datasheet.octopart.com:443/GRM2165C1H751JA01D-Murata-datasheet-138743557.pdf?src-supplier=Ciiva; ComponentLink11URL: https://datasheet.octopart.com:443/GRM2165C1H751JA01D-Murata-datasheet-102.pdf?src-supplier=DigiKey; ComponentLink11Description: https://datasheet.octopart.com:443/GRM2165C1H751JA01D-Murata-datasheet-102.pdf?src-supplier=DigiKey; ComponentLink12URL: http://sigma.octopart.com:80/reach_statement/Murata-company-16.pdf?src-supplier=Compliance+Statements; ComponentLink12Description: http://sigma.octopart.com:80/reach_statement/Murata-company-16.pdf?src-supplier=Compliance+Statements
C26 = CAP: Capacitor SMD Generic; Manufacturer: *; Manufacturer Part Number: *; Tolerance: *; Voltage Rating: *; Dielectric: *; Package Size: 0805
C27 = CAP: Ceramic Capacitor, Multilayer, Ceramic, 100V, 5% +Tol, 5% -Tol, C0G, 0.015uF, Surface Mount, 2012M/0805; Manufacturer: Murata Electronics; Manufacturer Part Number: GRM2165C2A153JA01D; Manufacturer Lifecycle Status: IN PRODUCTION; Value: 15nF; Temperature Coefficient: 30ppm/°C; Tolerance: 5%; Voltage Rating: 100 V; Dielectric: Ceramic; Package Size: 0805; Supplier: DigiKey; Supplier Part Number: 490-GRM2165C2A153JA01DCT-ND; RoHS: Compliant; Category: Ceramic Capacitors; Stock: 4583; Pricing: 1=0.15, 10=0.085, 50=0.06, 100=0.0523, 500=0.03932, 1000=0.03531 (USD); Case/Package: 0805; Dielectric Material: Ceramic; Export Control Classification Number (ECCN) Code: EAR99; Height: 600µm; Harmonized Tariff Schedule (HTS) Code: 8532.24.00.20; Introduction Date: 2020-01-27; Length: 2mm; Lifecycle Status: Production; Material: Ceramic; Max Operating Temperature: 125°C; Min Operating Temperature: -55°C; Mounting Technology: Surface Mount; Number of Terminals: 2; REACH SVHC: Yes; Thickness: 600µm; Voltage Rating (DC): 100V; Width: 1.25mm; ComponentLink1URL: https://datasheet.octopart.com:443/GRM2165C2A153JA01D-Murata-datasheet-141276372.pdf?src-supplier=Geoflip; ComponentLink1Description: https://datasheet.octopart.com:443/GRM2165C2A153JA01D-Murata-datasheet-141276372.pdf?src-supplier=Geoflip; ComponentLink2URL: https://datasheet.octopart.com:443/GRM2165C2A153JA01D-Murata-datasheet-165579666.pdf?src-supplier=TME; ComponentLink2Description: https://datasheet.octopart.com:443/GRM2165C2A153JA01D-Murata-datasheet-165579666.pdf?src-supplier=TME; ComponentLink3URL: https://datasheet.octopart.com:443/GRM2165C2A153JA01D-Murata-datasheet-140706081.pdf?src-supplier=Ciiva; ComponentLink3Description: https://datasheet.octopart.com:443/GRM2165C2A153JA01D-Murata-datasheet-140706081.pdf?src-supplier=Ciiva; ComponentLink4URL: https://datasheet.octopart.com:443/GRM2165C2A153JA01D-Murata-datasheet-138743583.pdf?src-supplier=Ciiva; ComponentLink4Description: https://datasheet.octopart.com:443/GRM2165C2A153JA01D-Murata-datasheet-138743583.pdf?src-supplier=Ciiva; ComponentLink5URL: https://datasheet.octopart.com/GRM2165C2A153JA01D-Murata-datasheet-12515295.pdf; ComponentLink5Description: https://datasheet.octopart.com/GRM2165C2A153JA01D-Murata-datasheet-12515295.pdf; ComponentLink6URL: https://datasheet.octopart.com/GRM2165C2A153JA01D-Murata-datasheet-12510076.pdf; ComponentLink6Description: https://datasheet.octopart.com/GRM2165C2A153JA01D-Murata-datasheet-12510076.pdf; ComponentLink7URL: https://datasheet.octopart.com/GRM2165C2A153JA01D-Murata-datasheet-11978611.pdf; ComponentLink7Description: https://datasheet.octopart.com/GRM2165C2A153JA01D-Murata-datasheet-11978611.pdf; ComponentLink8URL: https://datasheet.octopart.com/GRM2165C2A153JA01D-Murata-datasheet-10025737.pdf; ComponentLink8Description: https://datasheet.octopart.com/GRM2165C2A153JA01D-Murata-datasheet-10025737.pdf; ComponentLink9URL: https://datasheet.octopart.com/GRM2165C2A153JA01D-Murata-datasheet-8819587.pdf; ComponentLink9Description: https://datasheet.octopart.com/GRM2165C2A153JA01D-Murata-datasheet-8819587.pdf; ComponentLink10URL: http://sigma.octopart.com:80/reach_statement/Murata-company-16.pdf?src-supplier=Compliance+Statements; ComponentLink10Description: http://sigma.octopart.com:80/reach_statement/Murata-company-16.pdf?src-supplier=Compliance+Statements
J13 = CONN_2x2_2.54mm_PinHeader_Vertical: Pin Header, Board-to-Board, 2.54 mm, 2 Rows, 4 Contacts, Through Hole, TSW Series; Manufacturer: Samtec; Manufacturer Part Number: TSW-102-07-F-D; Manufacturer Lifecycle Status: PRODUCTION; Connector Type: Male Pin; Gender: Male; Max Current Rating: 7.6A; Max Voltage Rating (AC): 550V; Number of Contacts: 4; Pitch: 2.54mm; Supplier: DigiKey; Supplier Part Number: SAM10843-ND; RoHS: Compliant; Category: Headers and Wire Housings; Stock: 11283; Pricing: 1=0.22, 50=0.19, 100=0.16, 500=0.14, 1000=0.11, 2000=0.1, 5000=0.09, 10000=0.08206 (USD); Color: Black; Contact Material: Bronze; Contact Mating Length: 5.842mm; Contact Plating: Gold; Depth: 5.08mm; Housing Color: Black; Housing Material: Polyester; Lead Pitch: 2.54mm; Length: 5.08mm; Lifecycle Status: Production; Max Operating Temperature: 125°C; Min Operating Temperature: -55°C; Mounting Technology: Through Hole; Number of Positions: 4; Number of Rows: 2; Orientation: Straight; Radiation Hardening: No; REACH SVHC: No; Row Spacing: 2.54mm; Termination: Solder; ComponentLink1URL: https://datasheet.octopart.com:443/TSW-102-07-F-D-Samtec-datasheet-97325576.pdf?src-supplier=Sager+Electronics; ComponentLink1Description: https://datasheet.octopart.com:443/TSW-102-07-F-D-Samtec-datasheet-97325576.pdf?src-supplier=Sager+Electronics; ComponentLink2URL: https://datasheet.octopart.com:443/TSW-102-07-F-D-Samtec-datasheet-151455181.pdf?src-supplier=Sager+Electronics; ComponentLink2Description: https://datasheet.octopart.com:443/TSW-102-07-F-D-Samtec-datasheet-151455181.pdf?src-supplier=Sager+Electronics; ComponentLink3URL: https://sigma.octopart.com:443/97325577/technical_drawing/Samtec-TSW-102-07-F-D.pdf?src-supplier=HQonline; ComponentLink3Description: https://sigma.octopart.com:443/97325577/technical_drawing/Samtec-TSW-102-07-F-D.pdf?src-supplier=HQonline; ComponentLink4URL: https://datasheet.octopart.com:443/TSW-102-07-F-D-Samtec-datasheet-62107121.pdf?src-supplier=Farnell; ComponentLink4Description: https://datasheet.octopart.com:443/TSW-102-07-F-D-Samtec-datasheet-62107121.pdf?src-supplier=Farnell; ComponentLink5URL: https://datasheet.octopart.com:443/TSW-102-07-F-D-Samtec-datasheet-136646178.pdf?src-supplier=Master+Electronics; ComponentLink5Description: https://datasheet.octopart.com:443/TSW-102-07-F-D-Samtec-datasheet-136646178.pdf?src-supplier=Master+Electronics; ComponentLink6URL: https://datasheet.octopart.com:443/TSW-102-07-F-D-Samtec-datasheet-118235302.pdf?src-supplier=Electro+Sonic; ComponentLink6Description: https://datasheet.octopart.com:443/TSW-102-07-F-D-Samtec-datasheet-118235302.pdf?src-supplier=Electro+Sonic; ComponentLink7URL: https://datasheet.octopart.com:443/TSW-102-07-F-D-Samtec-datasheet-180258786.pdf?src-supplier=JRH+Electronics; ComponentLink7Description: https://datasheet.octopart.com:443/TSW-102-07-F-D-Samtec-datasheet-180258786.pdf?src-supplier=JRH+Electronics; ComponentLink8URL: https://datasheet.octopart.com:443/TSW-102-07-F-D-Samtec-datasheet-160657603.pdf?src-supplier=Toby+Electronics; ComponentLink8Description: https://datasheet.octopart.com:443/TSW-102-07-F-D-Samtec-datasheet-160657603.pdf?src-supplier=Toby+Electronics; ComponentLink9URL: https://datasheet.octopart.com:443/TSW-102-07-F-D-Samtec-datasheet-116539033.pdf?src-supplier=Toby+Electronics; ComponentLink9Description: https://datasheet.octopart.com:443/TSW-102-07-F-D-Samtec-datasheet-116539033.pdf?src-supplier=Toby+Electronics; ComponentLink10URL: https://datasheet.octopart.com:443/TSW-102-07-F-D-Samtec-datasheet-116536310.pdf?src-supplier=Toby+Electronics; ComponentLink10Description: https://datasheet.octopart.com:443/TSW-102-07-F-D-Samtec-datasheet-116536310.pdf?src-supplier=Toby+Electronics; ComponentLink11URL: https://datasheet.octopart.com/TSW-102-07-F-D-Samtec-datasheet-86818365.pdf; ComponentLink11Description: https://datasheet.octopart.com/TSW-102-07-F-D-Samtec-datasheet-86818365.pdf; ComponentLink12URL: https://datasheet.octopart.com:443/TSW-102-07-F-D-Samtec-datasheet-11047283.pdf?src-supplier=Newark; ComponentLink12Description: https://datasheet.octopart.com:443/TSW-102-07-F-D-Samtec-datasheet-11047283.pdf?src-supplier=Newark